# EAGLE design trinketm0fader_35mmad (EAGLE 9.4.2)
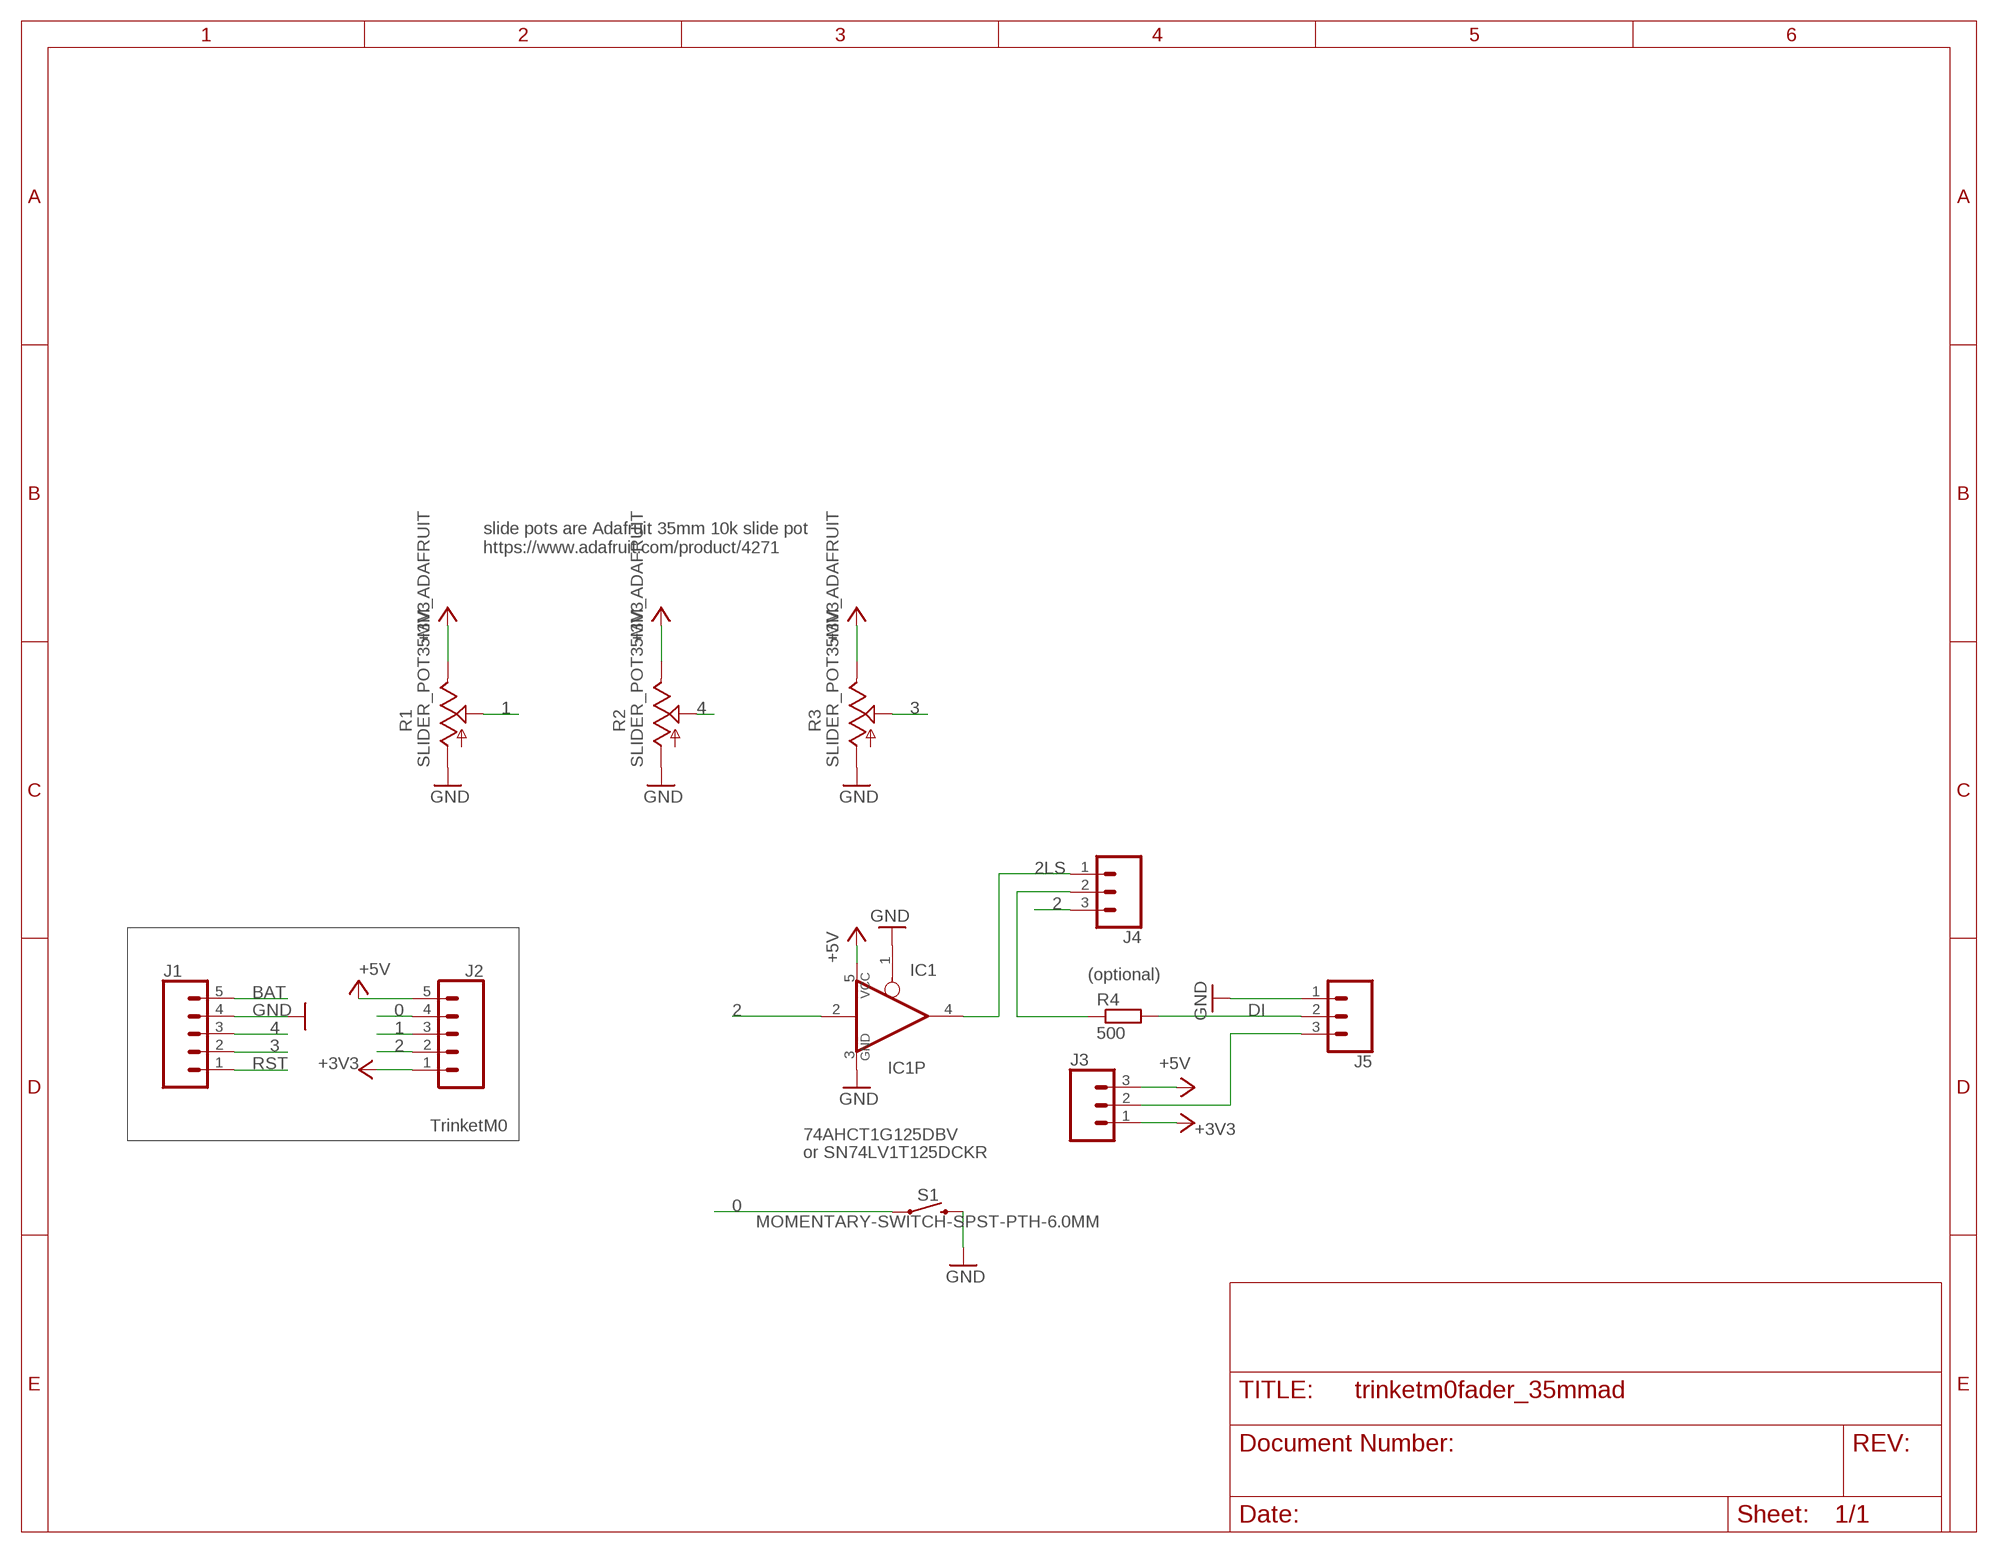
[diagram p0: schematic, sheet 1]

## Parts
IC1  74AHCT1G125DBV  [SOT23-5]
J1  CONN_05  [1X05]
J2  CONN_05  [1X05]
J3  CONN_03  [1X03]
J4  CONN_03  [1X03]
J5  CONN_03  [1X03]
R1  SLIDER_POT35MM_ADAFRUIT  [SLIDEPOD_35MM_ADAFRUIT]
R2  SLIDER_POT35MM_ADAFRUIT  [SLIDEPOD_35MM_ADAFRUIT]
R3  SLIDER_POT35MM_ADAFRUIT  [SLIDEPOD_35MM_ADAFRUIT]
R4  500  R-EU_R0603  [R0603]
S1  MOMENTARY-SWITCH-SPST-PTH-6.0MM  [TACTILE_SWITCH_PTH_6.0MM]

## Nets
0: J2.4 S1.1
1: J2.3 R1.P$2(W)
2: IC1.2(I) J2.2 J4.3
2LS: IC1.4(O) J4.1
3: J1.2 R3.P$2(W)
4: J1.3 R2.P$2(W)
+3V3: J2.1 J3.1 R1.P$1(V) R2.P$1(V) R3.P$1(V)
+5V: IC1.5(VCC) J2.5 J3.3
BAT: J1.5
DI: J5.2 R4.2
GND: IC1.1(OE) IC1.3(GND) J1.4 J5.1 R1.P$3(G) R2.P$3(G) R3.P$3(G) S1.3
N$1: J3.2 J5.3
N$3: J4.2 R4.1
RST: J1.1

## Notes on the sheet
- slide pots are Adafruit 35mm 10k slide pot
  https://www.adafruit.com/product/4271
- (optional)
- TrinketM0
- or SN74LV1T125DCKR

## Library data of the parts
IC1 = 74xx-little-us:74*1G125: Single Bus Buffer Gate with 3-State Output
J1 J2 = SparkFun-Connectors:CONN_05: Multi connection point. Often used as Generic Header-pin footprint for 0.1 inch spaced/style header connections On any of the 0.1 inch spaced packages, you can populate with these: Break Away Headers - Straight <https://www.sparkfun.com/products/116> (PRT-00116) Break Away Male Headers - Right Angle <https://www.sparkfun.com/products/553> (PRT-00553) Female Headers <https://www.sparkfun.com/products/115> (PRT-00115) Break Away Headers - Machine Pin <https://www.sparkfun.com/products/117> (PRT-00117) Break Away Female Headers - Swiss Machine Pin <https://www.sparkfun.com/products/743> (PRT-00743) For SCREWTERMINALS and SPRING TERMINALS visit here: Screw Terimnals on SparkFun.com <https://www.sparkfun.com/search/results?term=Screw+Terminals> (5mm/3.5mm/2.54mm spacing) This device is also useful as a general connection point to wire up your design to another part of your project. Our various solder wires solder well into these plated through hole pads. Hook-Up Wire - Assortment (Stranded, 22 AWG) <https://www.sparkfun.com/products/11375> (PRT-11375) Hook-Up Wire - Assortment (Solid Core, 22 AWG) <https://www.sparkfun.com/products/11367> (PRT-11367) View the entire wire category on our website here <https://www.sparkfun.com/categories/141> Special notes: Molex polarized connector foot print use with SKU : PRT-08231 with associated crimp pins and housings. 1MM SMD Version SKU: PRT-10208
J3-J5 = SparkFun-Connectors:CONN_03: Multi connection point. Often used as Generic Header-pin footprint for 0.1 inch spaced/style header connections On any of the 0.1 inch spaced packages, you can populate with these: Break Away Headers - Straight <https://www.sparkfun.com/products/116> (PRT-00116) Break Away Male Headers - Right Angle <https://www.sparkfun.com/products/553> (PRT-00553) Female Headers <https://www.sparkfun.com/products/115> (PRT-00115) Break Away Headers - Machine Pin <https://www.sparkfun.com/products/117> (PRT-00117) Break Away Female Headers - Swiss Machine Pin <https://www.sparkfun.com/products/743> (PRT-00743) Stackable Header - 3 Pin (Female, 0.1") <https://www.sparkfun.com/products/13875> (PRT-13875) For SCREWTERMINALS and SPRING TERMINALS visit here: Screw Terimnals on SparkFun.com <https://www.sparkfun.com/search/results?term=Screw+Terminals> (5mm/3.5mm/2.54mm spacing) This device is also useful as a general connection point to wire up your design to another part of your project. Our various solder wires solder well into these plated through hole pads. Hook-Up Wire - Assortment (Stranded, 22 AWG) <https://www.sparkfun.com/products/11375> (PRT-11375) Hook-Up Wire - Assortment (Solid Core, 22 AWG) <https://www.sparkfun.com/products/11367> (PRT-11367) View the entire wire category on our website here <https://www.sparkfun.com/categories/141> Special notes: Molex polarized connector foot print use with SKU : PRT-08232 with associated crimp pins and housings.
R1-R3 = todstuff:SLIDER_POT
R4 = rcl:R-EU_: RESISTOR, European symbol; SPICEPREFIX: R
S1 = SparkFun-Switches:MOMENTARY-SWITCH-SPST: Momentary Switch (Pushbutton) - SPST Normally-open (NO) SPST momentary switches (buttons, pushbuttons). Variants PTH-12MM - 12mm square, through-hole Momentary Pushbutton Switch - 12mm Square <https://www.sparkfun.com/products/9190> (COM-09190) PTH-6.0MM, PTH-6.0MM-KIT - 6.0mm square, through-hole Mini Pushbutton Switch <https://www.sparkfun.com/products/97> (COM-00097) KIT package intended for soldering kit's - only one side of pads' copper is exposed. PTH-RIGHT-ANGLE-KIT - Right-angle, through-hole Right Angle Tactile Button <https://www.sparkfun.com/products/10791> - Used on SparkFun BigTime Watch Kit <https://www.sparkfun.com/products/11734> SMD-12MM - 12mm square, surface-mount Tactile Button - SMD (12mm) <https://www.sparkfun.com/products/12993> (COM-12993) Used on SparkFun PicoBoard <https://www.sparkfun.com/products/11888> SMD-4.5MM - 4.5mm Square Trackball Switch Used on SparkFun Blackberry Trackballer Breakout <https://www.sparkfun.com/products/13169> SMD-4.6MMX2.8MM - 4.60mm x 2.80mm, surface mount Used on SparkFun SAMD21 Mini Breakout <https://www.sparkfun.com/products/13664> SMD-5.2MM, SMD-5.2-REDUNDANT - 5.2mm square, surface-mount Mini Pushbutton Switch - SMD <https://www.sparkfun.com/products/8720> (COM-08720) Used on Arduino Pro Mini <https://www.sparkfun.com/products/11114> REDUNDANT package connects both switch circuits together SMD-6.0X3.5MM - 6.0 x 3.5mm, surface mount Momentary Reset Switch SMD <https://www.sparkfun.com/products/8229> (COM-08229) SMD-6.2MM-TALL - 6.2mm square, surface mount Tactile Button - SMD (6mm) <https://www.sparkfun.com/products/12992> Used on SparkFun Digital Sandbox <https://www.sparkfun.com/products/12651> SMD-RIGHT-ANGLE - Right-angle, surface mount Used on SparkFun Block for Intel® Edison - Arduino <https://www.sparkfun.com/products/13036>; PROD_ID: SWCH-08441; SF_SKU: COM-00097

## Board
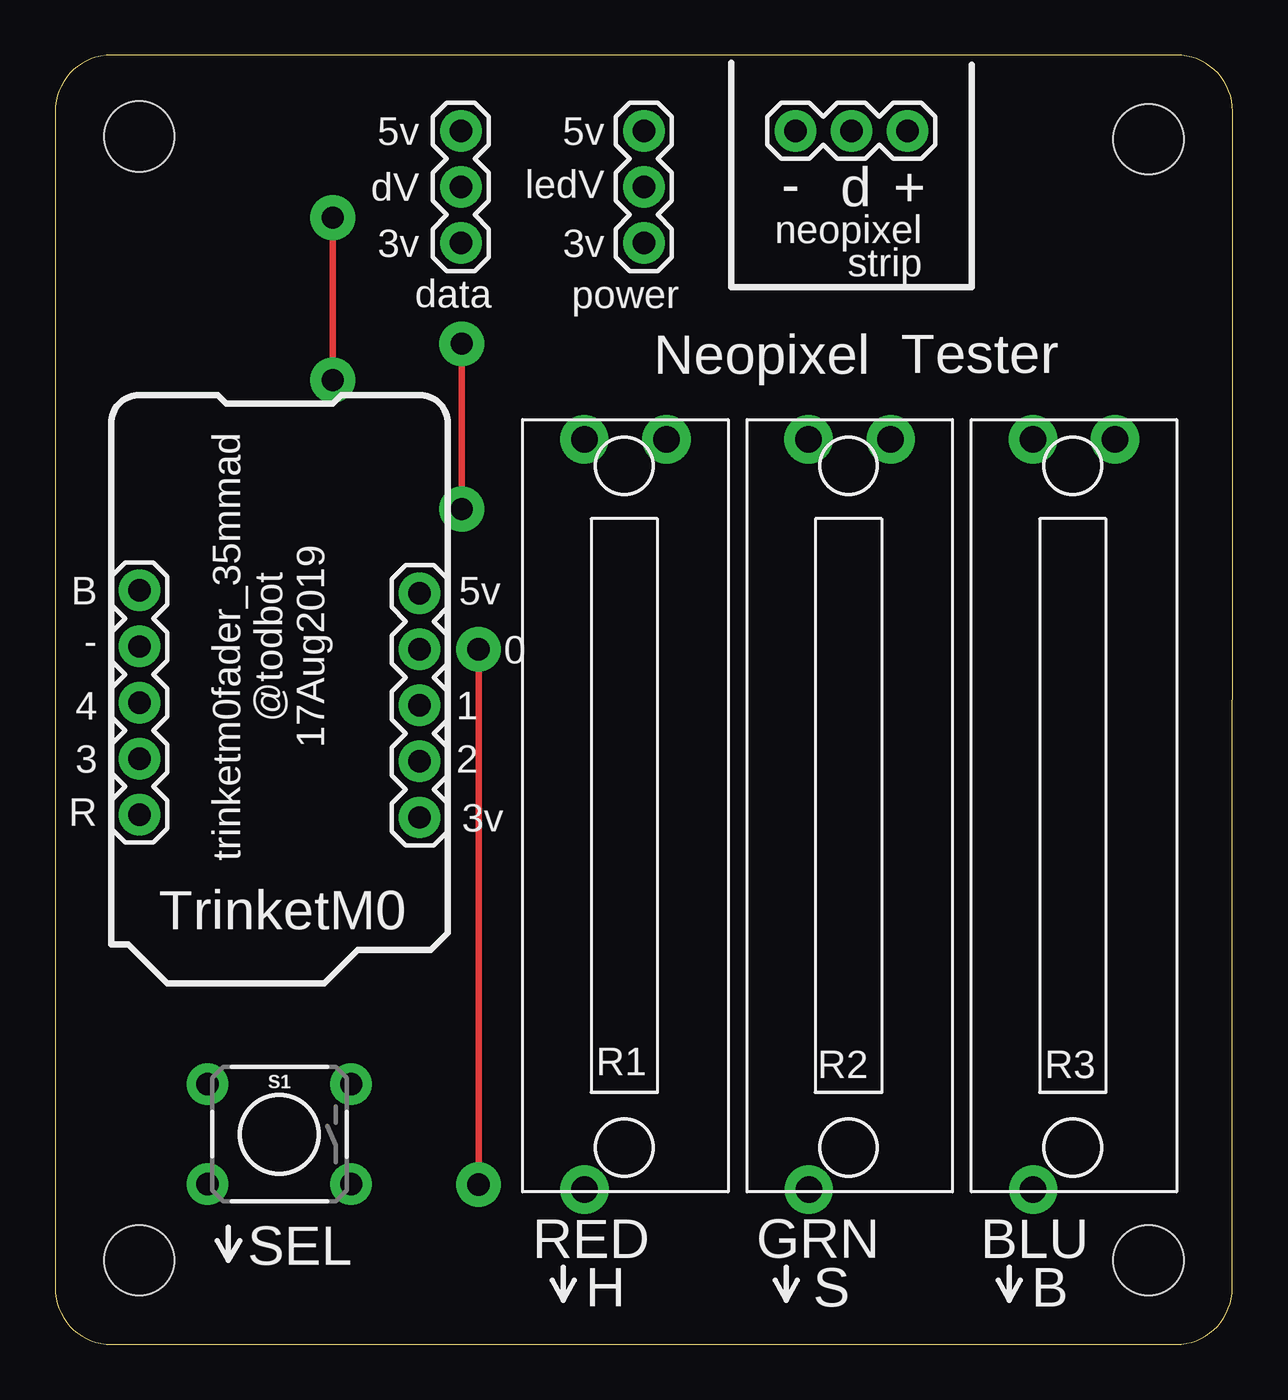
[diagram p1: board, top side]
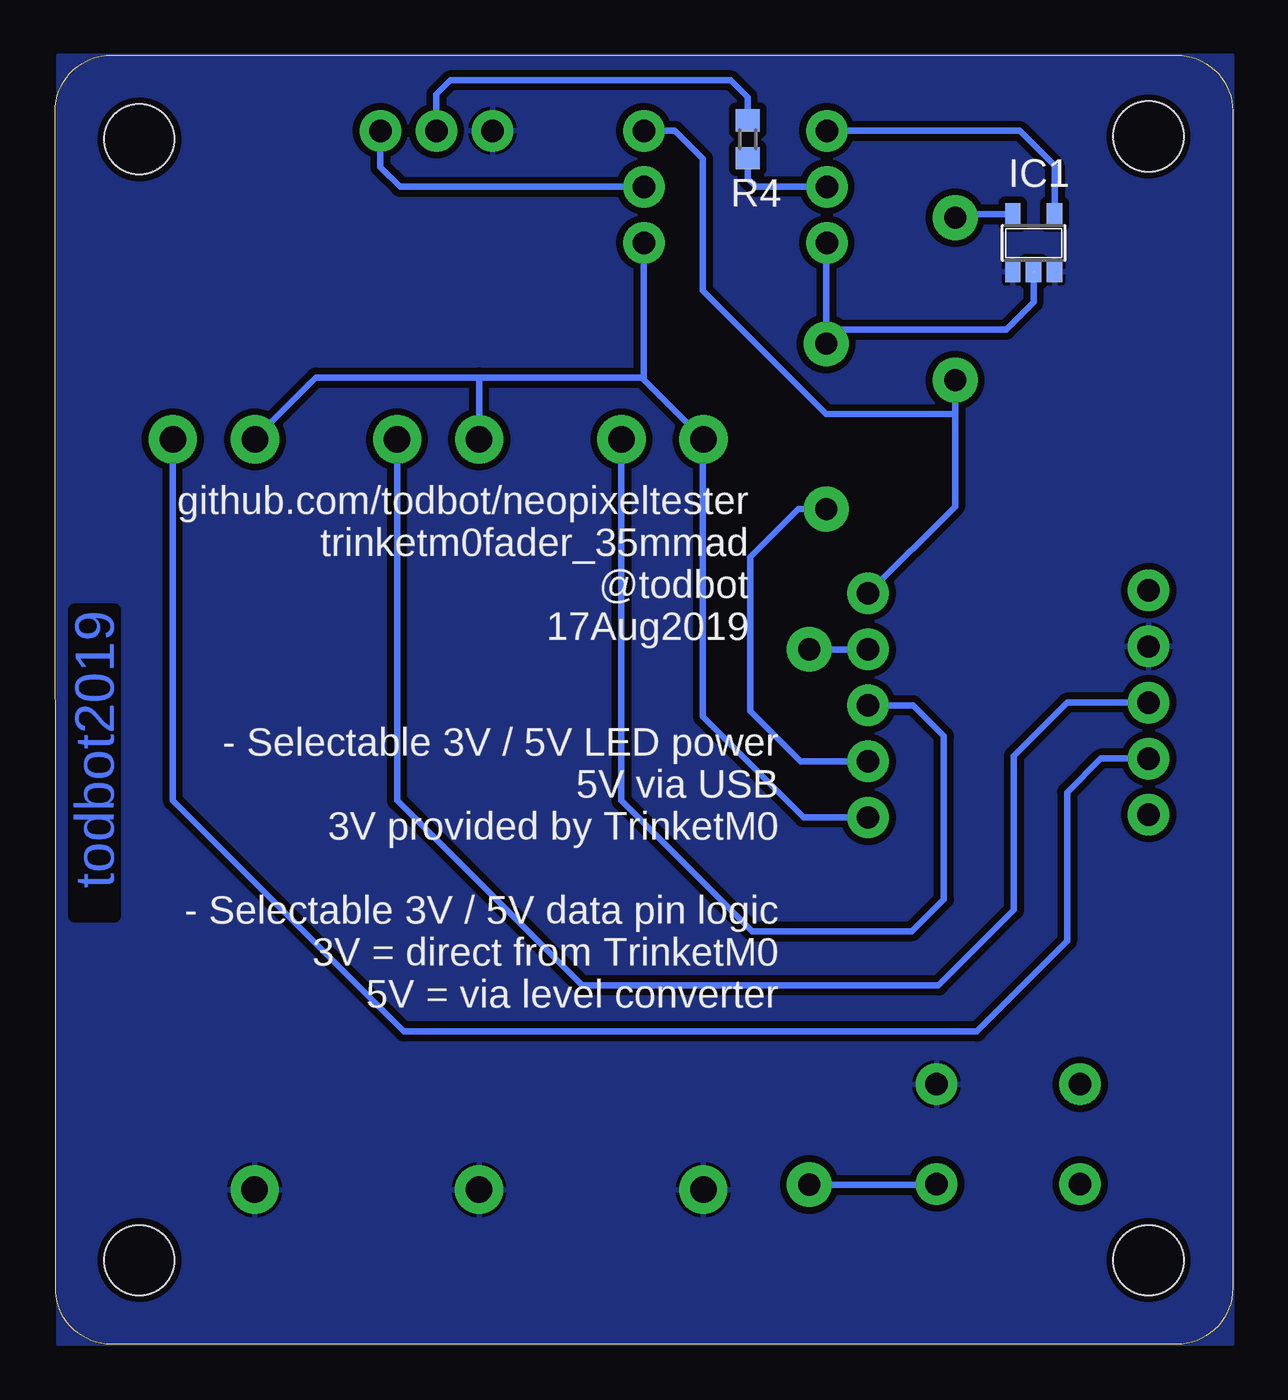
[diagram p2: board, bottom side, seen from below]

Size 53.34 x 58.42 mm. Coordinates in mm from the lower left corner, seen from the top.
Outline: 0,55.88 0,2.54 arc90 2.54,0 50.78,0 arc90 53.32,2.54 53.34,55.88 arc90 50.8,58.42 2.54,58.42 arc90 0,55.88
Copper layers (1*16): Top 0.035mm / dielectric 1.5mm / Bottom 0.035mm
Design rules "OthermillDRC_30_deg_v2": minimum track width 6mil, minimum drill 0.8mm, track to track 6mil, track to pad 6mil, pad to pad 6mil, via to via 6mil, smd to smd 0mil, copper to edge 0mil, drill to drill 6mil, minimum pad ring 10mil, minimum via ring 10mil, stop-mask expansion 1mil, vias tented up to drill 30mil, thermal gap 6mil
Holes 3.17 mm at 3.81,3.81 49.53,3.81 3.81,54.74 49.53,54.61

### Footprints (pad centres in the part's own frame; a part is rotated, then mirrored left to right if it is on the bottom)
SOT23-5 = smd 0.69 x 0.99: 1 -0.95,-1.29; 2 0,-1.29; 3 0.95,-1.29; 4 0.95,1.3; 5 -0.95,1.3
1X05 = drill 1.016 pad 1.88: 1 0,0; 2 2.54,0; 3 5.08,0; 4 7.62,0; 5 10.16,0
1X03 = drill 1.016 pad 1.88: 1 0,0; 2 2.54,0; 3 5.08,0
SLIDEPOD_35MM_ADAFRUIT = drill 1.2 pad 2.184: P$1 6.51,0.9; P$2 2.79,0.9; P$3 6.5,34.9
R0603 = smd 1 x 1.1: 1 -0.85,0; 2 0.85,0
TACTILE_SWITCH_PTH_6.0MM = drill 1.016 pad 1.88: 1 -3.251,2.261; 2 3.251,2.261; 3 -3.251,-2.261; 4 3.251,-2.261

### Placement (x,y rotation side)
IC1  9.02,49.91 0 bottom
J1  3.81,24 90 top
J2  16.51,23.88 90 top
J3  26.67,49.91 90 top
J4  18.38,54.99 270 top
J5  33.53,54.99 0 top
R1  30.48,41.91 180 top
R2  40.64,41.91 180 top
R3  50.8,41.91 180 top
R4  21.97,54.61 90 bottom
S1  10.16,9.53 180 top

### Tracks (layer width: path | path; a pad name or v marks a point on that pad's centre or on a via)
0  (via drill 1 pad 2.03)
  Top 0.305: v19.18,31.5 v19.18,7.24
  Bottom 0.305: v19.18,7.24 13.44,7.24 S1.1 | J2.4 v19.18,31.5
1
  Bottom 0.305: J2.3 14.48,28.96 13.08,27.56 13.08,20.16 14.53,18.71 21.76,18.71 27.69,24.64 R1.P$2
2  (via drill 1 pad 2.03)
  Top 0.305: v18.41,45.34 v18.41,37.85
  Bottom 0.305: J2.2 19.56,26.42 21.84,28.7 21.84,35.69 19.69,37.85 v18.41,37.85 | J4.3 18.41,49.88 18.41,45.97 | IC1.2 9.02,47.22 10.27,45.97 18.41,45.97 | 18.41,45.97 v18.41,45.34
2LS
  Bottom 0.305: J4.1 9.65,54.99 8.07,53.41 IC1.4
3
  Bottom 0.305: J1.2 5.97,26.54 7.49,25.02 7.49,18.27 11.58,14.18 37.55,14.18 48.01,24.64 R3.P$2
4
  Bottom 0.305: J1.3 7.49,29.08 9.91,26.67 9.91,19.68 13.34,16.26 29.46,16.26 37.85,24.64 R2.P$2
+3V3
  Bottom 0.305: J2.1 19.43,23.88 24,28.45 24,40.98 R1.P$1 26.67,43.71 | R3.P$1 44.32,41.02 41.53,43.81 34.13,43.81 | R2.P$1 34.13,43.81 | 26.67,43.71 J3.1 | 34.13,43.81 26.77,43.81 26.67,43.71
+5V  (via drill 1 pad 2.03)
  Top 0.305: v12.57,51.05 v12.57,43.69
  Bottom 0.305: v12.57,43.69 12.57,42.16 | 12.57,42.16 12.57,37.97 J2.5 | J3.3 25.27,54.99 24,53.72 24,47.75 18.41,42.16 12.57,42.16 | IC1.5 12.42,51.21 v12.57,51.05
DI
  Bottom 0.305: J5.2 36.07,56.64 35.43,57.28 22.73,57.28 21.97,56.52 R4.2
GND
  pour Bottom (isolate 0.305): 0,58.42 53.21,58.42 53.21,0 0,0
N$1
  Bottom 0.305: J5.3 38.61,53.34 37.72,52.45 J3.2
N$3
  Bottom 0.305: J4.2 21.59,52.45 21.97,52.83 R4.1

### Text on the board
Bottom: todbot2019
tPlace: 5v | 5v | dV | ledV | - | d | + | neopixel | 3v | 3v | data | power | strip | Neopixel | Tester | 5v | B | trinketm0fader_35mmad / @todbot / 17Aug2019 | 0 | - | 1 | 4 | 2 | 3 | 3v | R | TrinketM0 | SEL | RED | GRN | BLU | H | S | B
bPlace: github.com/todbot/neopixeltester / trinketm0fader_35mmad / @todbot / 17Aug2019 | - Selectable 3V / 5V LED power / 5V via USB / 3V provided by TrinketM0 / / - Selectable 3V / 5V data pin logic / 3V = direct from TrinketM0 / 5V = via level converter
Reference: Keep clear / for USB cable